# Altium schematic sheet Vdd.SchDoc: Myon Deco - Positive Supply
size A; DrawnBy: Matias Lopez; Revision: Prototype; SheetNumber: 7; SheetTotal: 7
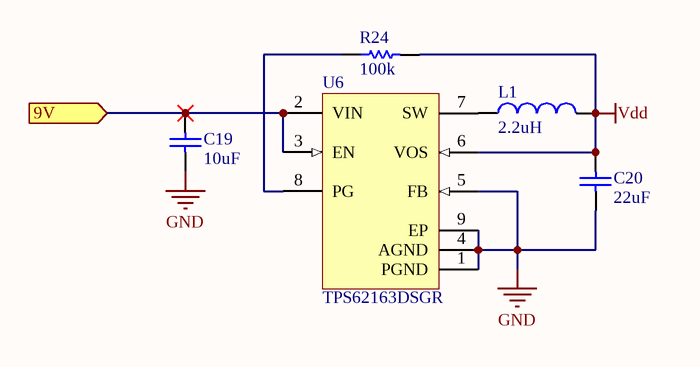
[diagram p0: Vdd.SchDoc]

## Parts
C19  value 10uF  [C1206]  (hidden comment: Cap)
C20  value 22uF  [C1206]  (hidden comment: Cap)
L1  value 2.2uH  [INDC1608L]  (hidden comment: Inductor)
R24  value 100k  [C1206]  (hidden comment: Res1)
U6  TPS62163DSGR  [DSG8-1600X900TP]

## Ports
9V (in)

## Nets
GND: C19.1 C20.1 U6.1(PGND) U6.4(AGND) U6.5(FB) U6.9(EP)
Vdd: C20.2 L1.2 R24.2 U6.6(VOS)
9V: C19.2 U6.2(VIN) U6.3(EN) ; port 9V
NetL1_1: L1.1 U6.7(SW)
NetR24_1: R24.1 U6.8(PG)

## Library data of the parts
C19 C20 = Cap: Capacitor; Published: 8-Jun-2000; LatestRevisionDate: 17-Jul-2002; LatestRevisionNote: Re-released for DXP Platform.; PackageReference: RAD-0.3; Publisher: Altium Limited; PackageDescription: Radial Cap, Thru-Hole; 2 Leads; 0.3 in Pin Spacing
L1 = Inductor: Code_IEC: 1005; Published: 8-Jun-2000; LatestRevisionDate: 29-May-2009; LatestRevisionNote: IPC-7351 Footprint Added.; PackageReference: 0402-A; Publisher: Altium Limited; PackageDescription: Chip Inductor; Code_JEITA: 0402
R24 = Res1: Resistor; Published: 8-Jun-2000; LatestRevisionDate: 17-Jul-2002; LatestRevisionNote: Re-released for DXP Platform.; PackageReference: AXIAL-0.3; Publisher: Altium Limited; PackageDescription: Axial Device, Thru-Hole; 2 Leads; 0.3 in Pin Spacing
U6 = TPS62163DSGR: Buck Step Down Regulator with 3 to 17 V Input and 5 V Output, -40 to 85 degC, 8-Pin WSON (DSG), Green (RoHS & no Sb/Br); Manufacturer: Texas Instruments; Duty Cycle(Max)(%): 100; Iout(Max)(A): 1; Iq(Typ)(mA): 0.017; Preset Vout(V): 5; Rating: Catalog; SubFamily: Step-Down Regulator; Switch Current Limit(Typ)(A): 1.8; Synchronous Rectification: TRUE; Vin(Max)(V): 17; Vin(Min)(V): 3; DatasheetVersion: SLVSAM2A; PackageVersion: revB, Oct-2010; PackageReference: DSG8-1600X900TP; PackageDescription: 8-Pin Plastic Small Outline No-Lead, 2 x 2 x 0.8 mm Body, 0.5 mm Pitch, Exposed Pad; Supplier 1: Digi-Key; Supplier Part Number 1: 296-29898-2-ND; Supplier 2: Digi-Key; Supplier Part Number 2: 296-29898-1-ND; Supplier 3: Digi-Key; Supplier Part Number 3: 296-29898-6-ND; Supplier 4: Newark; Supplier Part Number 4: 74T5559; Supplier 5: Mouser; Supplier Part Number 5: 595-TPS62163DSGR; Eco-Plan: Green (RoHS & no Sb/Br); Regulated Outputs(#): 1; Topology: Buck; Vout(Max)(V): 5; Vout(Min)(V): 5; Mounting Technology: Surface Mount; Code_JEDEC: MO-229; PartNumber: TPS62163DSGR; ComponentLink1Description: Datasheet; ComponentLink1URL: http://www.ti.com/general/docs/lit/getliterature.tsp?genericPartNumber=TPS62163&fileType=pdf; ComponentLink2Description: Package Specification; ComponentLink2URL: http://www.ti.com/litv/pdf/mpds308a; ComponentLink3Description: URL Link1; ComponentLink3URL: Samples URL:http://www.ti.com/product/tps62163#samples